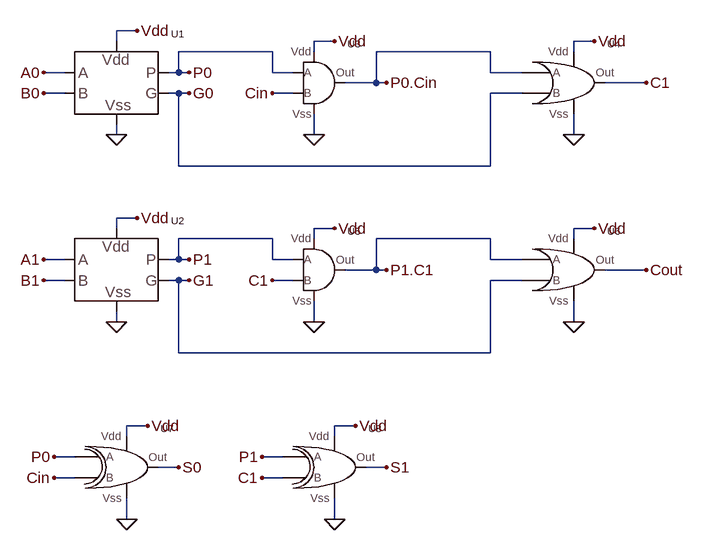
[diagram p0: schematic 2_Bit_CLA.asc]
2_Bit_CLA.asc, the LTspice schematic file:
Version 4
SHEET 1 880 984
WIRE -48 -112 -80 -112
WIRE -80 -96 -80 -112
WIRE 256 -96 224 -96
WIRE 656 -96 624 -96
WIRE 160 -80 16 -80
WIRE 224 -80 224 -96
WIRE 496 -80 320 -80
WIRE 624 -80 624 -96
WIRE -160 -48 -192 -48
WIRE 16 -48 16 -80
WIRE 16 -48 0 -48
WIRE 32 -48 16 -48
WIRE 160 -48 160 -80
WIRE 192 -48 160 -48
WIRE 496 -48 496 -80
WIRE 544 -48 496 -48
WIRE 320 -32 320 -80
WIRE 320 -32 272 -32
WIRE 336 -32 320 -32
WIRE 736 -32 672 -32
WIRE -160 -16 -192 -16
WIRE 16 -16 0 -16
WIRE 32 -16 16 -16
WIRE 192 -16 160 -16
WIRE 544 -16 496 -16
WIRE -80 48 -80 32
WIRE 224 48 224 16
WIRE 624 48 624 16
WIRE 16 96 16 -16
WIRE 496 96 496 -16
WIRE 496 96 16 96
WIRE -48 176 -80 176
WIRE -80 192 -80 176
WIRE 256 192 224 192
WIRE 656 192 624 192
WIRE 160 208 16 208
WIRE 224 208 224 192
WIRE 496 208 320 208
WIRE 624 208 624 192
WIRE -160 240 -192 240
WIRE 16 240 16 208
WIRE 16 240 0 240
WIRE 32 240 16 240
WIRE 160 240 160 208
WIRE 192 240 160 240
WIRE 496 240 496 208
WIRE 544 240 496 240
WIRE 320 256 320 208
WIRE 320 256 272 256
WIRE 336 256 320 256
WIRE 736 256 672 256
WIRE -160 272 -192 272
WIRE 16 272 0 272
WIRE 32 272 16 272
WIRE 192 272 160 272
WIRE 544 272 496 272
WIRE -80 336 -80 320
WIRE 224 336 224 304
WIRE 624 336 624 304
WIRE 16 384 16 272
WIRE 496 384 496 272
WIRE 496 384 16 384
WIRE -32 496 -64 496
WIRE 288 496 256 496
WIRE -64 512 -64 496
WIRE 256 512 256 496
WIRE -144 544 -176 544
WIRE 176 544 144 544
WIRE 16 560 -16 560
WIRE 336 560 304 560
WIRE -144 576 -176 576
WIRE 176 576 144 576
WIRE -64 640 -64 608
WIRE 256 640 256 608
FLAG -48 -112 Vdd
FLAG -48 176 Vdd
FLAG -80 336 0
FLAG -80 48 0
FLAG -192 -48 A0
FLAG -192 -16 B0
FLAG -192 240 A1
FLAG -192 272 B1
FLAG 32 -48 P0
FLAG 32 -16 G0
FLAG 32 240 P1
FLAG 32 272 G1
FLAG 224 48 0
FLAG 256 -96 Vdd
FLAG 160 -16 Cin
FLAG 336 -32 P0.Cin
FLAG 656 -96 Vdd
FLAG 624 48 0
FLAG 736 -32 C1
FLAG 224 336 0
FLAG 256 192 Vdd
FLAG 160 272 C1
FLAG 336 256 P1.C1
FLAG 624 336 0
FLAG 656 192 Vdd
FLAG 736 256 Cout
FLAG -32 496 Vdd
FLAG 288 496 Vdd
FLAG -64 640 0
FLAG 256 640 0
FLAG -176 544 P0
FLAG -176 576 Cin
FLAG 144 544 P1
FLAG 144 576 C1
FLAG 16 560 S0
FLAG 336 560 S1
SYMBOL PG_Generator -80 -32 R0
SYMATTR InstName U1
SYMBOL PG_Generator -80 256 R0
SYMATTR InstName U2
SYMBOL AND1 208 -32 R0
SYMATTR InstName U3
SYMBOL OR1 560 -32 R0
SYMATTR InstName U4
SYMBOL AND1 208 256 R0
SYMATTR InstName U5
SYMBOL OR1 560 256 R0
SYMATTR InstName U6
SYMBOL XOR1 -128 560 R0
SYMATTR InstName U7
SYMBOL XOR1 192 560 R0
SYMATTR InstName U8

The netlist it stands for:
* 2_Bit_CLA.asc
XU1 A0 B0 P0 G0 Vdd 0 PG_Generator  ; pins A B P G Vdd Vss
XU2 A1 B1 P1 G1 Vdd 0 PG_Generator  ; pins A B P G Vdd Vss
XU3 Vdd 0 P0 Cin P0.Cin AND1  ; pins Vdd Vss A B Out
XU4 Vdd 0 C1 P0.Cin G0 OR1  ; pins Vdd Vss Out A B
XU5 Vdd 0 P1 C1 P1.C1 AND1  ; pins Vdd Vss A B Out
XU6 Vdd 0 Cout P1.C1 G1 OR1  ; pins Vdd Vss Out A B
XU7 Vdd 0 S0 P0 Cin XOR1  ; pins Vdd Vss Out A B
XU8 Vdd 0 S1 P1 C1 XOR1  ; pins Vdd Vss Out A B
.lib PG_Generator.sub
.lib AND1.sub
.lib OR1.sub
.lib XOR1.sub
.backanno
.end